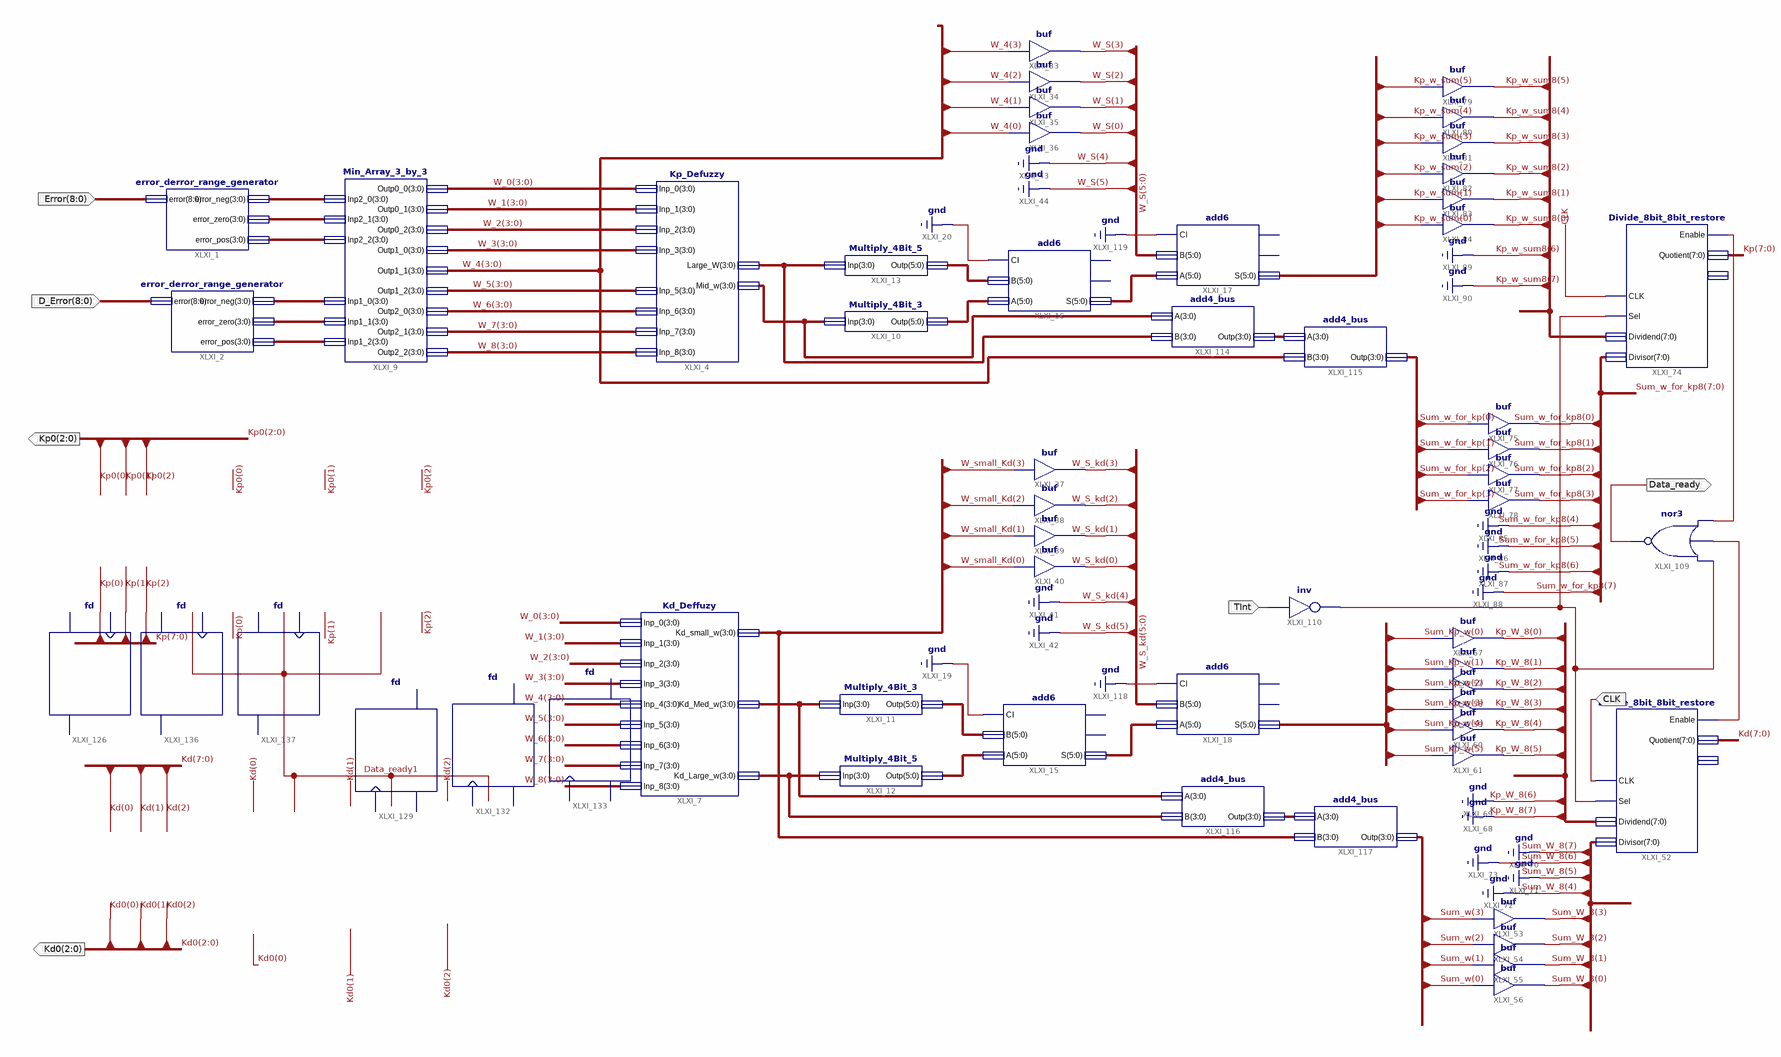
[diagram p0: schematic sheet 1]
// Xilinx ISE schematic FIRA_Fuzzy_1_0.sch (spartan3e) as structural Verilog: 55 symbols, 7 ports
module FIRA_Fuzzy_1_0 (
  input  [8:0] Error,
  input  [8:0] D_Error,
  input  TInt,
  input  CLK,
  output Data_ready,
  output [2:0] Kp0,
  output [2:0] Kd0
);

  wire Data_ready1, XLXN_298, XLXN_299, XLXN_304;
  wire [3:0] D_ERROR_NEG, D_ERROR_POS, D_ERROR_ZERO, ERROR_NEG, ERROR_POS, ERROR_ZERO, Sum_w, Sum_W_8,
       Sum_w_for_kp, Sum_w_for_kp8, W_0, W_1, W_2, W_3, W_4, W_5, W_6, W_7, W_8, W_S, W_S_kd, W_small_Kd,
       XLXN_23, XLXN_24, XLXN_53, XLXN_54, XLXN_124, XLXN_125;
  wire [5:0] Kp_W_8, Kp_w_sum, Kp_w_sum8, Sum_Kp_w, XLXN_58, XLXN_59, XLXN_60, XLXN_61, XLXN_64, XLXN_65;
  wire [7:0] Kd, Kp;

  error_derror_range_generator XLXI_2 (
    .error(D_Error), .error_neg(D_ERROR_NEG), .error_zero(D_ERROR_ZERO), .error_pos(D_ERROR_POS));
  error_derror_range_generator XLXI_1 (
    .error(Error), .error_neg(ERROR_NEG), .error_zero(ERROR_ZERO), .error_pos(ERROR_POS));
  Min_Array_3_by_3 XLXI_9 (
    .Outp0_0(W_0), .Outp0_1(W_1), .Outp0_2(W_2), .Outp1_0(W_3), .Outp1_1(W_4), .Outp1_2(W_5), .Outp2_0(W_6),
    .Outp2_1(W_7), .Outp2_2(W_8), .Inp2_0(ERROR_NEG), .Inp2_2(ERROR_POS), .Inp2_1(ERROR_ZERO),
    .Inp1_0(D_ERROR_NEG), .Inp1_1(D_ERROR_ZERO), .Inp1_2(D_ERROR_POS));
  Kp_Defuzzy XLXI_4 (
    .Inp_0(W_0), .Inp_1(W_1), .Inp_2(W_2), .Inp_3(W_3), .Inp_8(W_8), .Inp_7(W_7), .Inp_5(W_5), .Inp_6(W_6),
    .Mid_w(XLXN_24), .Large_W(XLXN_23));
  Multiply_4Bit_3 XLXI_10 (.Inp(XLXN_24), .Outp(XLXN_58));
  Multiply_4Bit_5 XLXI_13 (.Inp(XLXN_23), .Outp(XLXN_59));
  add6 XLXI_16 (.CI(1'b0), .B(XLXN_59), .A(XLXN_58), .S(XLXN_65));  // open: CO, OFL
  add6 XLXI_17 (.CI(1'b0), .B({2'b00, W_S}), .A(XLXN_65), .S(Kp_w_sum));  // open: CO, OFL
  Kd_Deffuzy XLXI_7 (
    .Kd_Med_w(XLXN_53), .Inp_8(W_8), .Inp_7(W_7), .Inp_6(W_6), .Inp_5(W_5), .Inp_4(W_4), .Inp_3(W_3),
    .Inp_2(W_2), .Inp_1(W_1), .Inp_0(W_0), .Kd_small_w(W_small_Kd), .Kd_Large_w(XLXN_54));
  Multiply_4Bit_3 XLXI_11 (.Inp(XLXN_53), .Outp(XLXN_61));
  Multiply_4Bit_5 XLXI_12 (.Inp(XLXN_54), .Outp(XLXN_60));
  add6 XLXI_15 (.CI(1'b0), .B(XLXN_61), .A(XLXN_60), .S(XLXN_64));  // open: CO, OFL
  add6 XLXI_18 (.CI(1'b0), .B({2'b00, W_S_kd}), .A(XLXN_64), .S(Sum_Kp_w));  // open: CO, OFL
  buf XLXI_33 (W_S[3], W_4[3]);
  buf XLXI_34 (W_S[2], W_4[2]);
  buf XLXI_35 (W_S[1], W_4[1]);
  buf XLXI_36 (W_S[0], W_4[0]);
  buf XLXI_37 (W_S_kd[3], W_small_Kd[3]);
  buf XLXI_38 (W_S_kd[2], W_small_Kd[2]);
  buf XLXI_39 (W_S_kd[1], W_small_Kd[1]);
  buf XLXI_40 (W_S_kd[0], W_small_Kd[0]);
  Divide_8bit_8bit_restore XLXI_52 (
    .Divisor({4'b0000, Sum_W_8}), .Dividend({2'b00, Kp_W_8}), .Sel(XLXN_304), .CLK(CLK), .Quotient(Kd),
    .Enable(XLXN_298));  // open: Remainder
  buf XLXI_53 (Sum_W_8[3], Sum_w[3]);
  buf XLXI_54 (Sum_W_8[2], Sum_w[2]);
  buf XLXI_55 (Sum_W_8[1], Sum_w[1]);
  buf XLXI_56 (Sum_W_8[0], Sum_w[0]);
  buf XLXI_57 (Kp_W_8[1], Sum_Kp_w[1]);
  buf XLXI_58 (Kp_W_8[2], Sum_Kp_w[2]);
  buf XLXI_59 (Kp_W_8[3], Sum_Kp_w[3]);
  buf XLXI_60 (Kp_W_8[4], Sum_Kp_w[4]);
  buf XLXI_61 (Kp_W_8[5], Sum_Kp_w[5]);
  buf XLXI_67 (Kp_W_8[0], Sum_Kp_w[0]);
  buf XLXI_79 (Kp_w_sum8[5], Kp_w_sum[5]);
  buf XLXI_80 (Kp_w_sum8[4], Kp_w_sum[4]);
  buf XLXI_81 (Kp_w_sum8[3], Kp_w_sum[3]);
  buf XLXI_82 (Kp_w_sum8[2], Kp_w_sum[2]);
  buf XLXI_83 (Kp_w_sum8[1], Kp_w_sum[1]);
  buf XLXI_84 (Kp_w_sum8[0], Kp_w_sum[0]);
  buf XLXI_75 (Sum_w_for_kp8[0], Sum_w_for_kp[0]);
  buf XLXI_76 (Sum_w_for_kp8[1], Sum_w_for_kp[1]);
  buf XLXI_77 (Sum_w_for_kp8[2], Sum_w_for_kp[2]);
  buf XLXI_78 (Sum_w_for_kp8[3], Sum_w_for_kp[3]);
  nor XLXI_109 (Data_ready, XLXN_304, XLXN_298, XLXN_299);
  not XLXI_110 (XLXN_304, TInt);
  add4_bus XLXI_114 (.A(XLXN_24), .B(XLXN_23), .Outp(XLXN_124));
  add4_bus XLXI_115 (.A(XLXN_124), .B(W_4), .Outp(Sum_w_for_kp));
  add4_bus XLXI_116 (.A(XLXN_53), .B(XLXN_54), .Outp(XLXN_125));
  add4_bus XLXI_117 (.A(XLXN_125), .B(W_small_Kd), .Outp(Sum_w));
  Divide_8bit_8bit_restore XLXI_74 (
    .Divisor({4'b0000, Sum_w_for_kp8}), .Dividend({2'b00, Kp_w_sum8}), .Sel(XLXN_304), .CLK(CLK),
    .Quotient(Kp), .Enable(XLXN_299));  // open: Remainder
  fd XLXI_129 (.C(Data_ready1), .D(Kd[0]), .Q(Kd0[0]));
  fd XLXI_132 (.C(Data_ready1), .D(Kd[1]), .Q(Kd0[1]));
  fd XLXI_133 (.C(Data_ready1), .D(Kd[2]), .Q(Kd0[2]));
  fd XLXI_126 (.C(Data_ready1), .D(Kp[0]), .Q(Kp0[0]));
  fd XLXI_136 (.C(Data_ready1), .D(Kp[1]), .Q(Kp0[1]));
  fd XLXI_137 (.C(Data_ready1), .D(Kp[2]), .Q(Kp0[2]));
endmodule
